# EAGLE schematic Pendant (EAGLE 9.6.2)

## Sheet 1 of 3
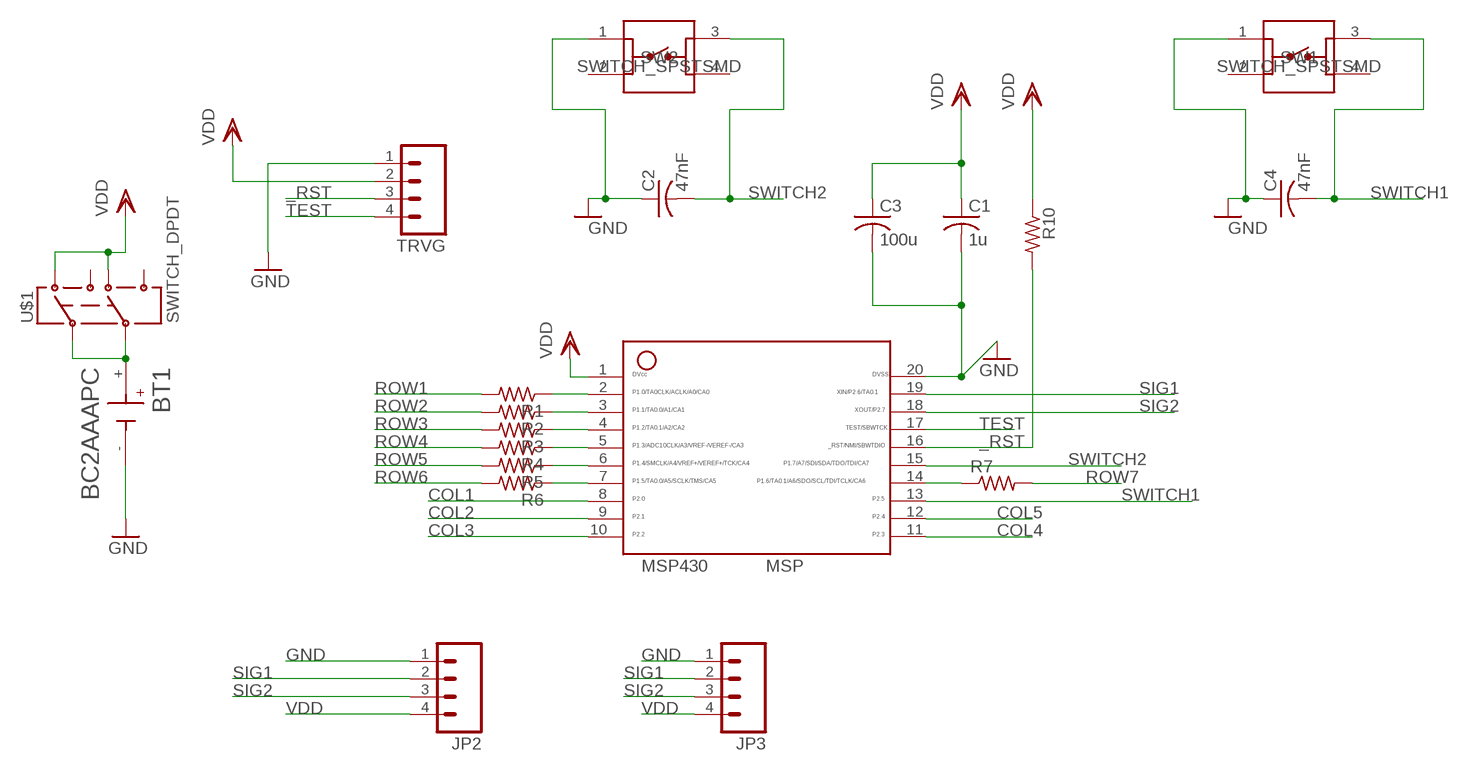
[diagram p0: schematic, sheet 1]

### Parts
BT1  BC2AAAPC  [BAT_BC2AAAPC]
C1  1u  C-USC0603  [C0603]
C2  47nF  C-USC0603  [C0603]
C3  100u  C-USC1206  [C1206]
C4  47nF  C-USC0603  [C0603]
JP2  M04LOCK  [1X04_LOCK]
JP3  M04LOCK  [1X04_LOCK]
MSP430  MSP  MSP430  [20_PIN]
R1  R-US_R0402  [R0402]
R2  R-US_R0402  [R0402]
R3  R-US_R0402  [R0402]
R4  R-US_R0402  [R0402]
R5  R-US_R0402  [R0402]
R6  R-US_R0402  [R0402]
R7  R-US_R0402  [R0402]
R10  R-US_R0402  [R0402]
SW1  SWITCH_SPSTSMD  [SW_1571563-4]
SW2  SWITCH_SPSTSMD  [SW_1571563-4]
TRVG  M04LOCK  [1X04_LOCK]
U$1  SWITCH_DPDT  [JS_DPDT_TH]

### Nets
_RST: MSP430.16 R10.2 TRVG.3
COL1: MSP430.8 ; also sheet 2
COL2: MSP430.9 ; also sheet 2
COL3: MSP430.10 ; also sheet 2
COL4: MSP430.11 ; also sheet 2
COL5: MSP430.12 ; also sheet 2
GND: BT1.- C1.2 C2.1 C3.2 C4.1 JP2.1 JP3.1 MSP430.20 SW1.1 SW2.1 TRVG.1
N$1: MSP430.14 R7.1
N$2: BT1.+ U$1.2 U$1.5
N$3: MSP430.2 R1.1
N$4: MSP430.3 R2.1
N$5: MSP430.4 R3.1
N$6: MSP430.5 R4.1
N$7: MSP430.6 R5.1
N$8: MSP430.7 R6.1
ROW1: R1.2 ; also sheet 2
ROW2: R2.2 ; also sheet 2
ROW3: R3.2 ; also sheet 2
ROW4: R4.2 ; also sheet 2
ROW5: R5.2 ; also sheet 2
ROW6: R6.2 ; also sheet 2
ROW7: R7.2 ; also sheet 2
SIG1: JP2.2 JP3.2 MSP430.19
SIG2: JP2.3 JP3.3 MSP430.18
SWITCH1: C4.2 MSP430.13 SW1.3
SWITCH2: C2.2 MSP430.15 SW2.3
TEST: MSP430.17 TRVG.4
VDD: C1.1 C3.1 JP2.4 JP3.4 MSP430.1 R10.1 TRVG.2 U$1.1 U$1.4
Unconnected: SW1.2 SW1.4 SW2.2 SW2.4 U$1.3 U$1.6

## Sheet 2 of 3
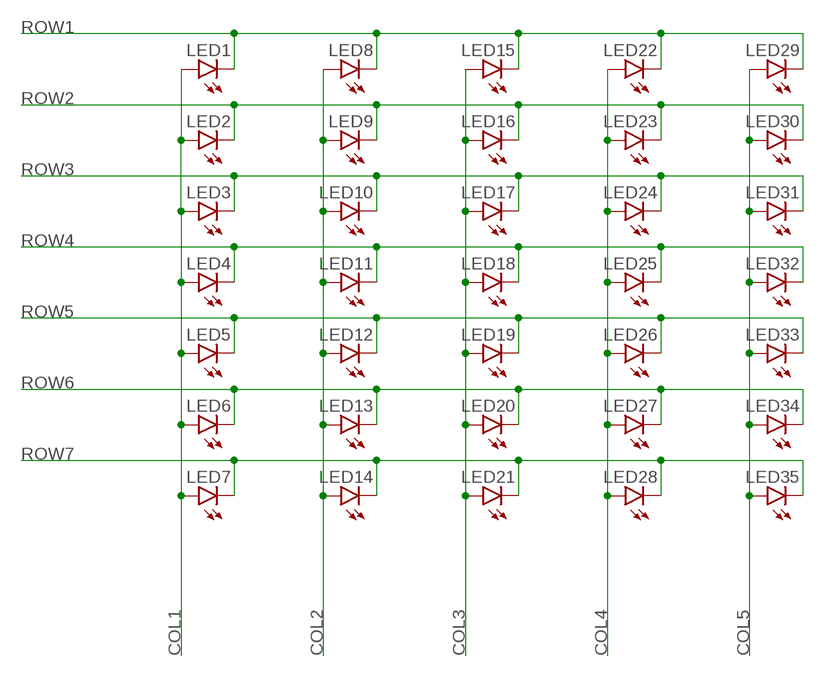
[diagram p1: schematic, sheet 2]

### Parts
LED1  LEDSML1206  [SML1206]
LED2  LEDSML1206  [SML1206]
LED3  LEDSML1206  [SML1206]
LED4  LEDSML1206  [SML1206]
LED5  LEDSML1206  [SML1206]
LED6  LEDSML1206  [SML1206]
LED7  LEDSML1206  [SML1206]
LED8  LEDSML1206  [SML1206]
LED9  LEDSML1206  [SML1206]
LED10  LEDSML1206  [SML1206]
LED11  LEDSML1206  [SML1206]
LED12  LEDSML1206  [SML1206]
LED13  LEDSML1206  [SML1206]
LED14  LEDSML1206  [SML1206]
LED15  LEDSML1206  [SML1206]
LED16  LEDSML1206  [SML1206]
LED17  LEDSML1206  [SML1206]
LED18  LEDSML1206  [SML1206]
LED19  LEDSML1206  [SML1206]
LED20  LEDSML1206  [SML1206]
LED21  LEDSML1206  [SML1206]
LED22  LEDSML1206  [SML1206]
LED23  LEDSML1206  [SML1206]
LED24  LEDSML1206  [SML1206]
LED25  LEDSML1206  [SML1206]
LED26  LEDSML1206  [SML1206]
LED27  LEDSML1206  [SML1206]
LED28  LEDSML1206  [SML1206]
LED29  LEDSML1206  [SML1206]
LED30  LEDSML1206  [SML1206]
LED31  LEDSML1206  [SML1206]
LED32  LEDSML1206  [SML1206]
LED33  LEDSML1206  [SML1206]
LED34  LEDSML1206  [SML1206]
LED35  LEDSML1206  [SML1206]

### Nets
COL1: LED1.A LED2.A LED3.A LED4.A LED5.A LED6.A LED7.A ; also sheet 1
COL2: LED8.A LED9.A LED10.A LED11.A LED12.A LED13.A LED14.A ; also sheet 1
COL3: LED15.A LED16.A LED17.A LED18.A LED19.A LED20.A LED21.A ; also sheet 1
COL4: LED22.A LED23.A LED24.A LED25.A LED26.A LED27.A LED28.A ; also sheet 1
COL5: LED29.A LED30.A LED31.A LED32.A LED33.A LED34.A LED35.A ; also sheet 1
ROW1: LED1.C LED8.C LED15.C LED22.C LED29.C ; also sheet 1
ROW2: LED2.C LED9.C LED16.C LED23.C LED30.C ; also sheet 1
ROW3: LED3.C LED10.C LED17.C LED24.C LED31.C ; also sheet 1
ROW4: LED4.C LED11.C LED18.C LED25.C LED32.C ; also sheet 1
ROW5: LED5.C LED12.C LED19.C LED26.C LED33.C ; also sheet 1
ROW6: LED6.C LED13.C LED20.C LED27.C LED34.C ; also sheet 1
ROW7: LED7.C LED14.C LED21.C LED28.C LED35.C ; also sheet 1

## Sheet 3 of 3

## Library data of the parts
BT1 = BC2AAAPC:BC2AAAPC: Holder 2 Aaa Cell w/Pc Pins; DESCRIPTION: BATTERY HOLDER AAA 2 CELL PC PIN; DIGI-KEY_PART_NUMBER: BC2AAAPC-ND; MF: MPD; MP: BC2AAAPC; PACKAGE: None; PURCHASE-URL: https://pricing.snapeda.com/search/part/BC2AAAPC/?ref=eda
C1-C4 = rcl:C-US: CAPACITOR, American symbol; SPICEPREFIX: C
JP2 JP3 TRVG = Pendant:M04: Header 4 Standard 4-pin 0.1" header. Use with straight break away headers (SKU : PRT-00116), right angle break away headers (PRT-00553), swiss pins (PRT-00743), machine pins (PRT-00117), and female headers (PRT-00115). Molex polarized connector foot print use with SKU : PRT-08231 with associated crimp pins and housings.
LED1-LED35 = led:LED: LED OSRAM: - CHIPLED LG R971, LG N971, LY N971, LG Q971, LY Q971, LO R971, LY R971 LH N974, LH R974 LS Q976, LO Q976, LY Q976 LO Q996 - Hyper CHIPLED LW Q18S LB Q993, LB Q99A, LB R99A - SideLED LS A670, LO A670, LY A670, LG A670, LP A670 LB A673, LV A673, LT A673, LW A673 LH A674 LY A675 LS A676, LA A676, LO A676, LY A676, LW A676 LS A679, LY A679, LG A679 - Hyper Micro SIDELED® LS Y876, LA Y876, LO Y876, LY Y876 LT Y87S - SmartLED LW L88C, LW L88S LB L89C, LB L89S, LG L890 LS L89K, LO L89K, LY L89K LS L896, LA L896, LO L896, LY L896 - TOPLED LS T670, LO T670, LY T670, LG T670, LP T670 LSG T670, LSP T670, LSY T670, LOP T670, LYG T670 LG T671, LOG T671, LSG T671 LB T673, LV T673, LT T673, LW T673 LH T674 LS T676, LA T676, LO T676, LY T676, LB T676, LH T676, LSB T676, LW T676 LB T67C, LV T67C, LT T67C, LS T67K, LO T67K, LY T67K, LW E67C LS E67B, LA E67B, LO E67B, LY E67B, LB E67C, LV E67C, LT E67C LW T67C LS T679, LY T679, LG T679 LS T770, LO T770, LY T770, LG T770, LP T770 LB T773, LV T773, LT T773, LW T773 LH T774 LS E675, LA E675, LY E675, LS T675 LS T776, LA T776, LO T776, LY T776, LB T776 LHGB T686 LT T68C, LB T68C - Hyper Mini TOPLED® LB M676 - Mini TOPLED Santana® LG M470 LS M47K, LO M47K, LY M47K Source: http://www.osram.convergy.de LUXEON: - LUMILED® LXK2-PW12-R00, LXK2-PW12-S00, LXK2-PW14-U00, LXK2-PW14-V00 LXK2-PM12-R00, LXK2-PM12-S00, LXK2-PM14-U00 LXK2-PE12-Q00, LXK2-PE12-R00, LXK2-PE12-S00, LXK2-PE14-T00, LXK2-PE14-U00 LXK2-PB12-K00, LXK2-PB12-L00, LXK2-PB12-M00, LXK2-PB14-N00, LXK2-PB14-P00, LXK2-PB14-Q00 LXK2-PR12-L00, LXK2-PR12-M00, LXK2-PR14-Q00, LXK2-PR14-R00 LXK2-PD12-Q00, LXK2-PD12-R00, LXK2-PD12-S00 LXK2-PH12-R00, LXK2-PH12-S00 LXK2-PL12-P00, LXK2-PL12-Q00, LXK2-PL12-R00 Source: www.luxeon.com KINGBRIGHT: KA-3528ASYC Source: www.kingbright.com
MSP430 = RatDBS:MSP430: MSP430 20 pins
R1-R7 R10 = rcl:R-US_: RESISTOR, American symbol; SPICEPREFIX: R
SW1 SW2 = ELEC327:SWITCH_SPST: TE Connectivity Alcoswitch, 6mm Switch Tactile OFF (ON) SPST Round Button PC Pins 0.05A 24VDC 100000Cycles 2.55N Thru-Hole Loose Through Hole Version 1825910-7 <https://www.digikey.com/en/products/detail/te-connectivity-alcoswitch-switches/1825910-7/1731414> Surface Mount Version 1571563-4 <https://www.digikey.com/en/products/detail/te-connectivity-alcoswitch-switches/1571563-4/2400231>
U$1 = ELEC327:SWITCH_DPDT